# Altium project 数控稳压电源.PrjPCB
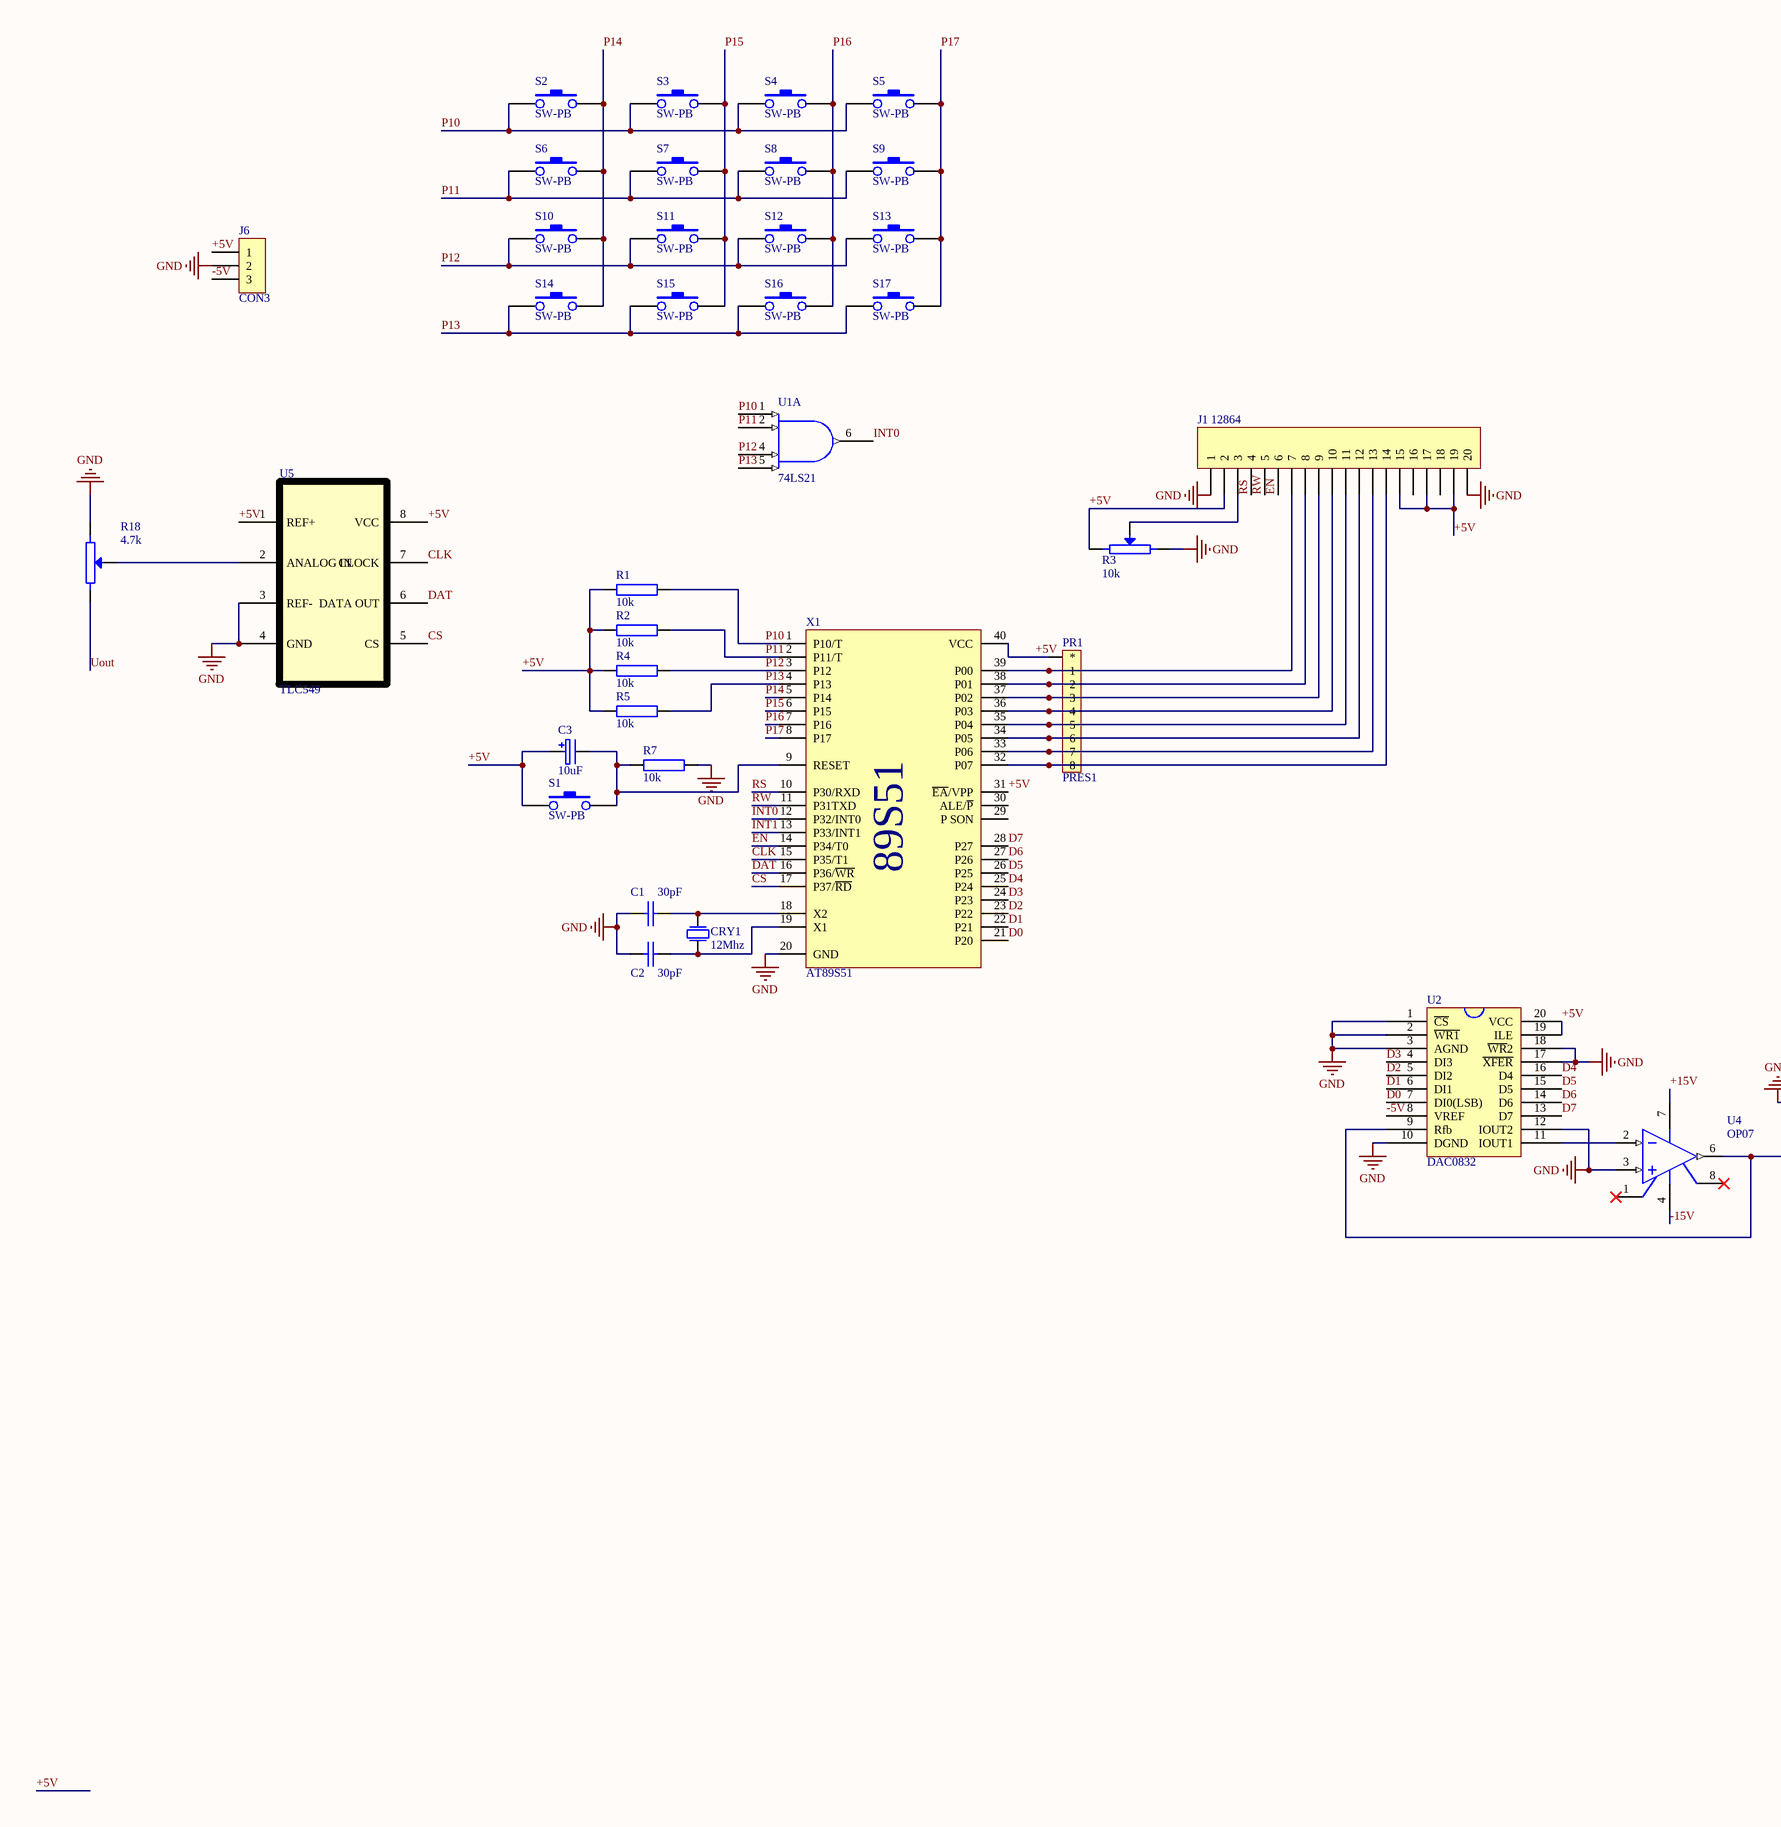
[diagram p0: 数控稳压电源.SchDoc, left]
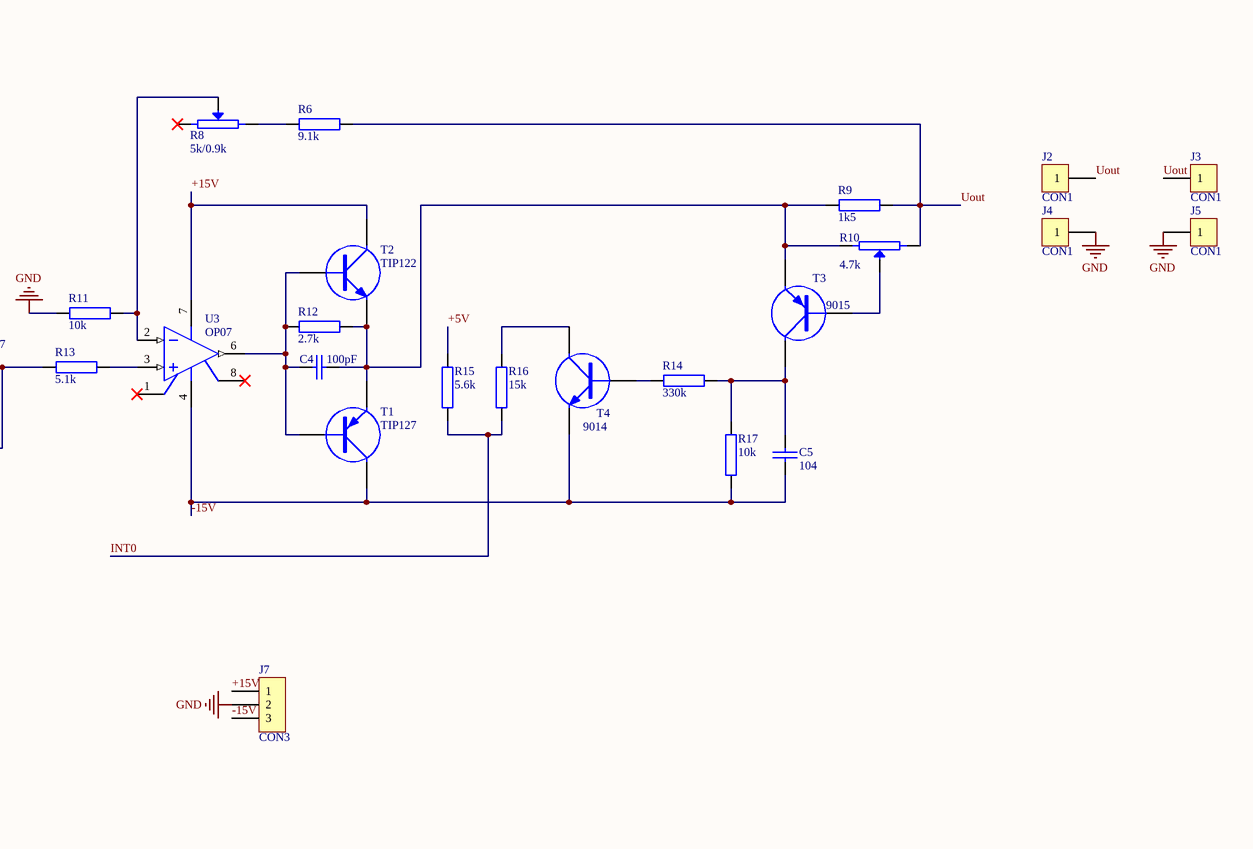
[diagram p1: 数控稳压电源.SchDoc, right]
1 sheet, 59 parts. Net scope: global (net labels, ports and power ports of the same name join across sheets).
Board file: 数控稳压电源.PcbDoc

## Sheet 数控稳压电源.SchDoc
size 635 x 495 mm

### Parts
C1  30pF  [CAP1]
C2  30pF  [CAP1]
C3  10uF  [RB1]
C4  100pF  [CAP1]
C5  104  [CAP1]
CRY1  12Mhz  [JZ1]
J1  12864  [sip20]
J2  CON1  [SIP-1]
J3  CON1  [SIP-1]
J4  CON1  [SIP-1]
J5  CON1  [SIP-1]
J6  CON3  [sip-3]
J7  CON3  [sip-3]
PR1  PRES1  [RP1]
R1  10k  [AXIAL0.3]
R2  10k  [AXIAL0.3]
R3  10k  [RVR-5]
R4  10k  [AXIAL0.3]
R5  10k  [AXIAL0.3]
R6  9.1k  [AXIAL0.3]
R7  10k  [AXIAL0.3]
R8  5k/0.9k  [VR5]
R9  1k5  [AXIAL0.3]
R10  4.7k  [VR5]
R11  10k  [AXIAL0.3]
R12  2.7k  [AXIAL0.3]
R13  5.1k  [AXIAL0.3]
R14  330k  [AXIAL0.3]
R15  5.6k  [AXIAL0.3]
R16  15k  [AXIAL0.3]
R17  10k  [AXIAL0.3]
R18  4.7k  [VR5]
S1  SW-PB  [SW6*6]
S2  SW-PB  [SW6*6]
S3  SW-PB  [SW6*6]
S4  SW-PB  [SW6*6]
S5  SW-PB  [SW6*6]
S6  SW-PB  [SW6*6]
S7  SW-PB  [SW6*6]
S8  SW-PB  [SW6*6]
S9  SW-PB  [SW6*6]
S10  SW-PB  [SW6*6]
S11  SW-PB  [SW6*6]
S12  SW-PB  [SW6*6]
S13  SW-PB  [SW6*6]
S14  SW-PB  [SW6*6]
S15  SW-PB  [SW6*6]
S16  SW-PB  [SW6*6]
S17  SW-PB  [SW6*6]
T1  TIP127  [TO220B]
T2  TIP122  [TO220B]
T3  9015  [TO-92]
T4  9014  [TO-92]
U1  74LS21  [DIP-14]  (part A of 2)
U2  DAC0832  [DIP-20]
U3  OP07  [DIP-8]
U4  OP07  [DIP-8]
U5  TLC549  [DIP-8]
X1  AT89S51  [DIP40]

### Nets
GND: C1.1 C2.1 J1.1 J1.20 J4.1 J5.1 J6.2 J7.2 R3.3 R7.2 R11.2 R18.1 U1.7(GND) U2.1(~{CS}) U2.2(~{WR1}) U2.3(AGND) U2.10(DGND) U2.12(IOUT2) U2.17(~{XFER}) U2.18(~{WR}2) U4.3(+IN) U5.3(REF-) U5.4(GND) X1.20(GND)
VCC: U1.14(VCC)
+5V: C3.1 J1.2 J1.15 J1.17 J1.19 J6.1 PR1.1 R1.1 R2.1 R3.1 R4.1 R5.1 R15.1 S1.1 U2.19(ILE) U2.20(VCC) U5.1(REF+) U5.8(VCC) X1.31(~{EA}/VPP) X1.40(VCC)
+15V: J7.1 T2.2(C) U3.7(V+) U4.7(V+)
-5V: J6.3 U2.8(VREF)
-15V: C5.1 J7.3 R17.2 T1.2(C) T4.1(E) U3.4(V-) U4.4(V-)
CLK: U5.7(CLOCK) X1.15(P35/T1)
CS: U5.5(CS) X1.17(P37/~{RD})
D0: U2.7(DI0(LSB)) X1.21(P20)
D1: U2.6(DI1) X1.22(P21)
D2: U2.5(DI2) X1.23(P22)
D3: U2.4(DI3) X1.24(P23)
D4: U2.16(D4) X1.25(P24)
D5: U2.15(D5) X1.26(P25)
D6: U2.14(D6) X1.27(P26)
D7: U2.13(D7) X1.28(P27)
DAT: U5.6(DATA_OUT) X1.16(P36/~{WR})
EN: J1.6 X1.14(P34/T0)
INT0: R15.2 R16.2 U1.6 X1.12(P32/INT0)
INT1: X1.13(P33/INT1)
P10: R1.2 S2.1 S3.1 S4.1 S5.1 U1.1 X1.1(P10/T)
P11: R2.2 S6.1 S7.1 S8.1 S9.1 U1.2 X1.2(P11/T)
P12: R4.2 S10.1 S11.1 S12.1 S13.1 U1.4 X1.3(P12)
P13: R5.2 S14.1 S15.1 S16.1 S17.1 U1.5 X1.4(P13)
P14: S2.2 S6.2 S10.2 S14.2 X1.5(P14)
P15: S3.2 S7.2 S11.2 S15.2 X1.6(P15)
P16: S4.2 S8.2 S12.2 S16.2 X1.7(P16)
P17: S5.2 S9.2 S13.2 S17.2 X1.8(P17)
RS: J1.4 X1.10(P30/RXD)
RW: J1.5 X1.11(P31TXD)
Uout: J2.1 J3.1 R6.1 R9.2 R10.1 R18.3
NetC1_2: C1.2 CRY1.1(P1) X1.18(X2)
NetC2_2: C2.2 CRY1.2(P2) X1.19(X1)
NetC3_2: C3.2 R7.1 S1.2 X1.9(RESET)
NetC4_1: C4.1 R12.2 T1.1(B) T2.1(B) U3.6(OUT)
NetC4_2: C4.2 R9.1 R10.3 R12.1 T1.3(E) T2.3(E) T3.1(E)
NetC5_2: C5.2 R14.2 R17.1 T3.3(C)
NetJ1_3: J1.3 R3.2(VT)
NetJ1_7: J1.7 PR1.2(1) X1.39(P00)
NetJ1_8: J1.8 PR1.3(2) X1.38(P01)
NetJ1_9: J1.9 PR1.4(3) X1.37(P02)
NetJ1_10: J1.10 PR1.5(4) X1.36(P03)
NetJ1_11: J1.11 PR1.6(5) X1.35(P04)
NetJ1_12: J1.12 PR1.7(6) X1.34(P05)
NetJ1_13: J1.13 PR1.8(7) X1.33(P06)
NetJ1_14: J1.14 PR1.9(8) X1.32(P07)
NetR6_2: R6.2 R8.3
NetR8_2: R8.2(VT) R11.1 U3.2(-IN)
NetR10_2: R10.2(VT) T3.2(B)
NetR13_1: R13.1 U2.9(Rfb) U4.6(OUT)
NetR13_2: R13.2 U3.3(+IN)
NetR14_1: R14.1 T4.2(B)
NetR16_1: R16.1 T4.3(C)
NetR18_2: R18.2(VT) U5.2(ANALOG_IN)
NetU2_11: U2.11(IOUT1) U4.2(-IN)

Not connected (* = marked no-connect by the designer): J1 16 18; R8 1*; U3 1(TRIM)* 8(TRIM)*; U4 1(TRIM)* 8(TRIM)*; X1 29(P_SON) 30(ALE/~{P})

### Notes on the sheet
- (in symbol AT89S51) 89S51

### Library data of the parts
C1 C2 C4 C5 = CAP1
C3 = CAP3
CRY1 = CRY1: 6.0000 8.000  11.0592  12.0000 24.000
J1 = CON20: Connector
J2-J5 = CON1: Connector
J6 J7 = CON3: Connector
R1 R2 R4-R7 R9 R11-R17 = RES
R3 R8 R10 R18 = RPOT2: Potentiometer
T1 = TIP42: PNP PLASTIC POWER TRANSISTORS
T2 = TIP41: NPN PLASTIC POWER TRANSISTORS
T3 = 9015: 低电平、低噪的前置放大器做放大或震荡
T4 = 9014: 低电平、低噪的前置放大器做放大或震荡
U3 U4 = OP07: Precision Operational Amplifier